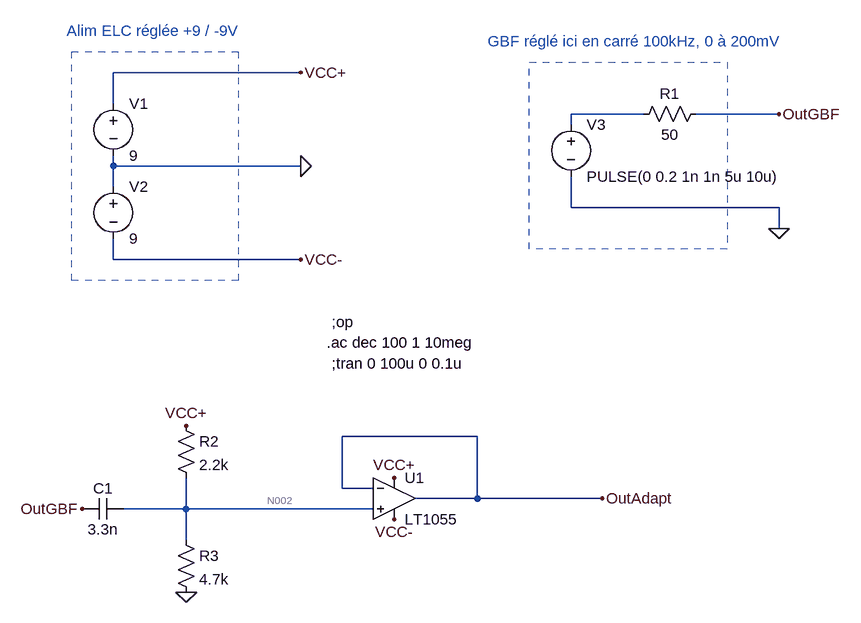
[diagram p0: schematic Draft5.asc]
Draft5.asc, the LTspice schematic file:
Version 4
SHEET 1 880 768
WIRE 16 -64 -272 -64
WIRE -272 -16 -272 -64
WIRE 544 0 432 0
WIRE 752 0 624 0
WIRE 432 16 432 0
WIRE -272 80 -272 64
WIRE 16 80 -272 80
WIRE -272 112 -272 80
WIRE 432 144 432 96
WIRE 752 144 432 144
WIRE 752 176 752 144
WIRE -272 224 -272 192
WIRE 16 224 -272 224
WIRE 288 496 80 496
WIRE 80 576 80 496
WIRE 128 576 80 576
WIRE 288 592 288 496
WIRE 288 592 192 592
WIRE 480 592 288 592
WIRE -160 608 -160 560
WIRE -160 608 -256 608
WIRE 128 608 -160 608
WIRE -160 656 -160 608
FLAG 16 80 0
FLAG 752 176 0
FLAG 16 -64 VCC+
FLAG 16 224 VCC-
FLAG 752 0 OutGBF
FLAG -160 736 0
FLAG -160 480 VCC+
FLAG 160 560 VCC+
FLAG 160 624 VCC-
FLAG -320 608 OutGBF
FLAG 480 592 OutAdapt
SYMBOL voltage -272 -32 R0
WINDOW 123 0 0 Left 2
WINDOW 39 0 0 Left 2
SYMATTR InstName V1
SYMATTR Value 9
SYMBOL voltage -272 96 R0
WINDOW 123 0 0 Left 2
WINDOW 39 0 0 Left 2
SYMATTR InstName V2
SYMATTR Value 9
SYMBOL voltage 432 0 R0
WINDOW 123 24 44 Left 2
WINDOW 39 0 0 Left 2
SYMATTR InstName V3
SYMATTR Value PULSE(0 0.2 1n 1n 5u 10u)
SYMBOL res 640 -16 R90
WINDOW 0 0 56 VBottom 2
WINDOW 3 32 56 VTop 2
SYMATTR InstName R1
SYMATTR Value 50
SYMBOL Opamps\\LT1055 160 528 R0
SYMATTR InstName U1
SYMBOL cap -256 592 R90
WINDOW 0 0 32 VBottom 2
WINDOW 3 32 32 VTop 2
SYMATTR InstName C1
SYMATTR Value 3.3n
SYMBOL res -176 464 R0
SYMATTR InstName R2
SYMATTR Value 2.2k
SYMBOL res -176 640 R0
SYMATTR InstName R3
SYMATTR Value 4.7k
TEXT -344 -128 Left 2 ;Alim ELC réglée +9 / -9V
TEXT 304 -112 Left 2 ;GBF réglé ici en carré 100kHz, 0 à 200mV
TEXT 56 352 Left 2 !.ac dec 100 1 10meg
TEXT 64 384 Left 2 !;tran 0 100u 0 0.1u
TEXT 64 320 Left 2 !;op
RECTANGLE Normal -80 256 -336 -96 2
RECTANGLE Normal 672 208 368 -80 2

The netlist it stands for:
* Draft5.asc
V1 VCC+ 0 9
V2 0 VCC- 9
V3 N001 0 PULSE(0 0.2 1n 1n 5u 10u)
R1 OutGBF N001 50
XU1 N002 OutAdapt VCC+ VCC- OutAdapt LT1055  ; pins In+ In- V+ V- OUT
C1 N002 OutGBF 3.3n
R2 VCC+ N002 2.2k
R3 N002 0 4.7k
* Alim ELC réglée +9 / -9V
* GBF réglé ici en carré 100kHz, 0 à 200mV
.ac dec 100 1 10meg
;tran 0 100u 0 0.1u
;op
.backanno
.end

* Results of the author's LTspice run, read from the files saved beside the schematic
* Operating Point, zero values left out:
*   V(vcc+) = 9 V
*   V(vcc-) = -9 V
*   V(outadapt) = 6.109 V
*   V(n002) = 6.13 V
*   I(R3) = 1.304 mA
*   I(R2) = 1.304 mA
*   I(V2) = -2.8 mA
*   I(V1) = -4.104 mA
*   Ix(u1:1) = 3.065 pA
*   Ix(u1:2) = 3.055 pA
*   Ix(u1:3) = 2.8 mA
*   Ix(u1:4) = -2.8 mA
*   Ix(u1:5) = -15.27 pA